# EAGLE design 51-zduino (EAGLE 5.07)
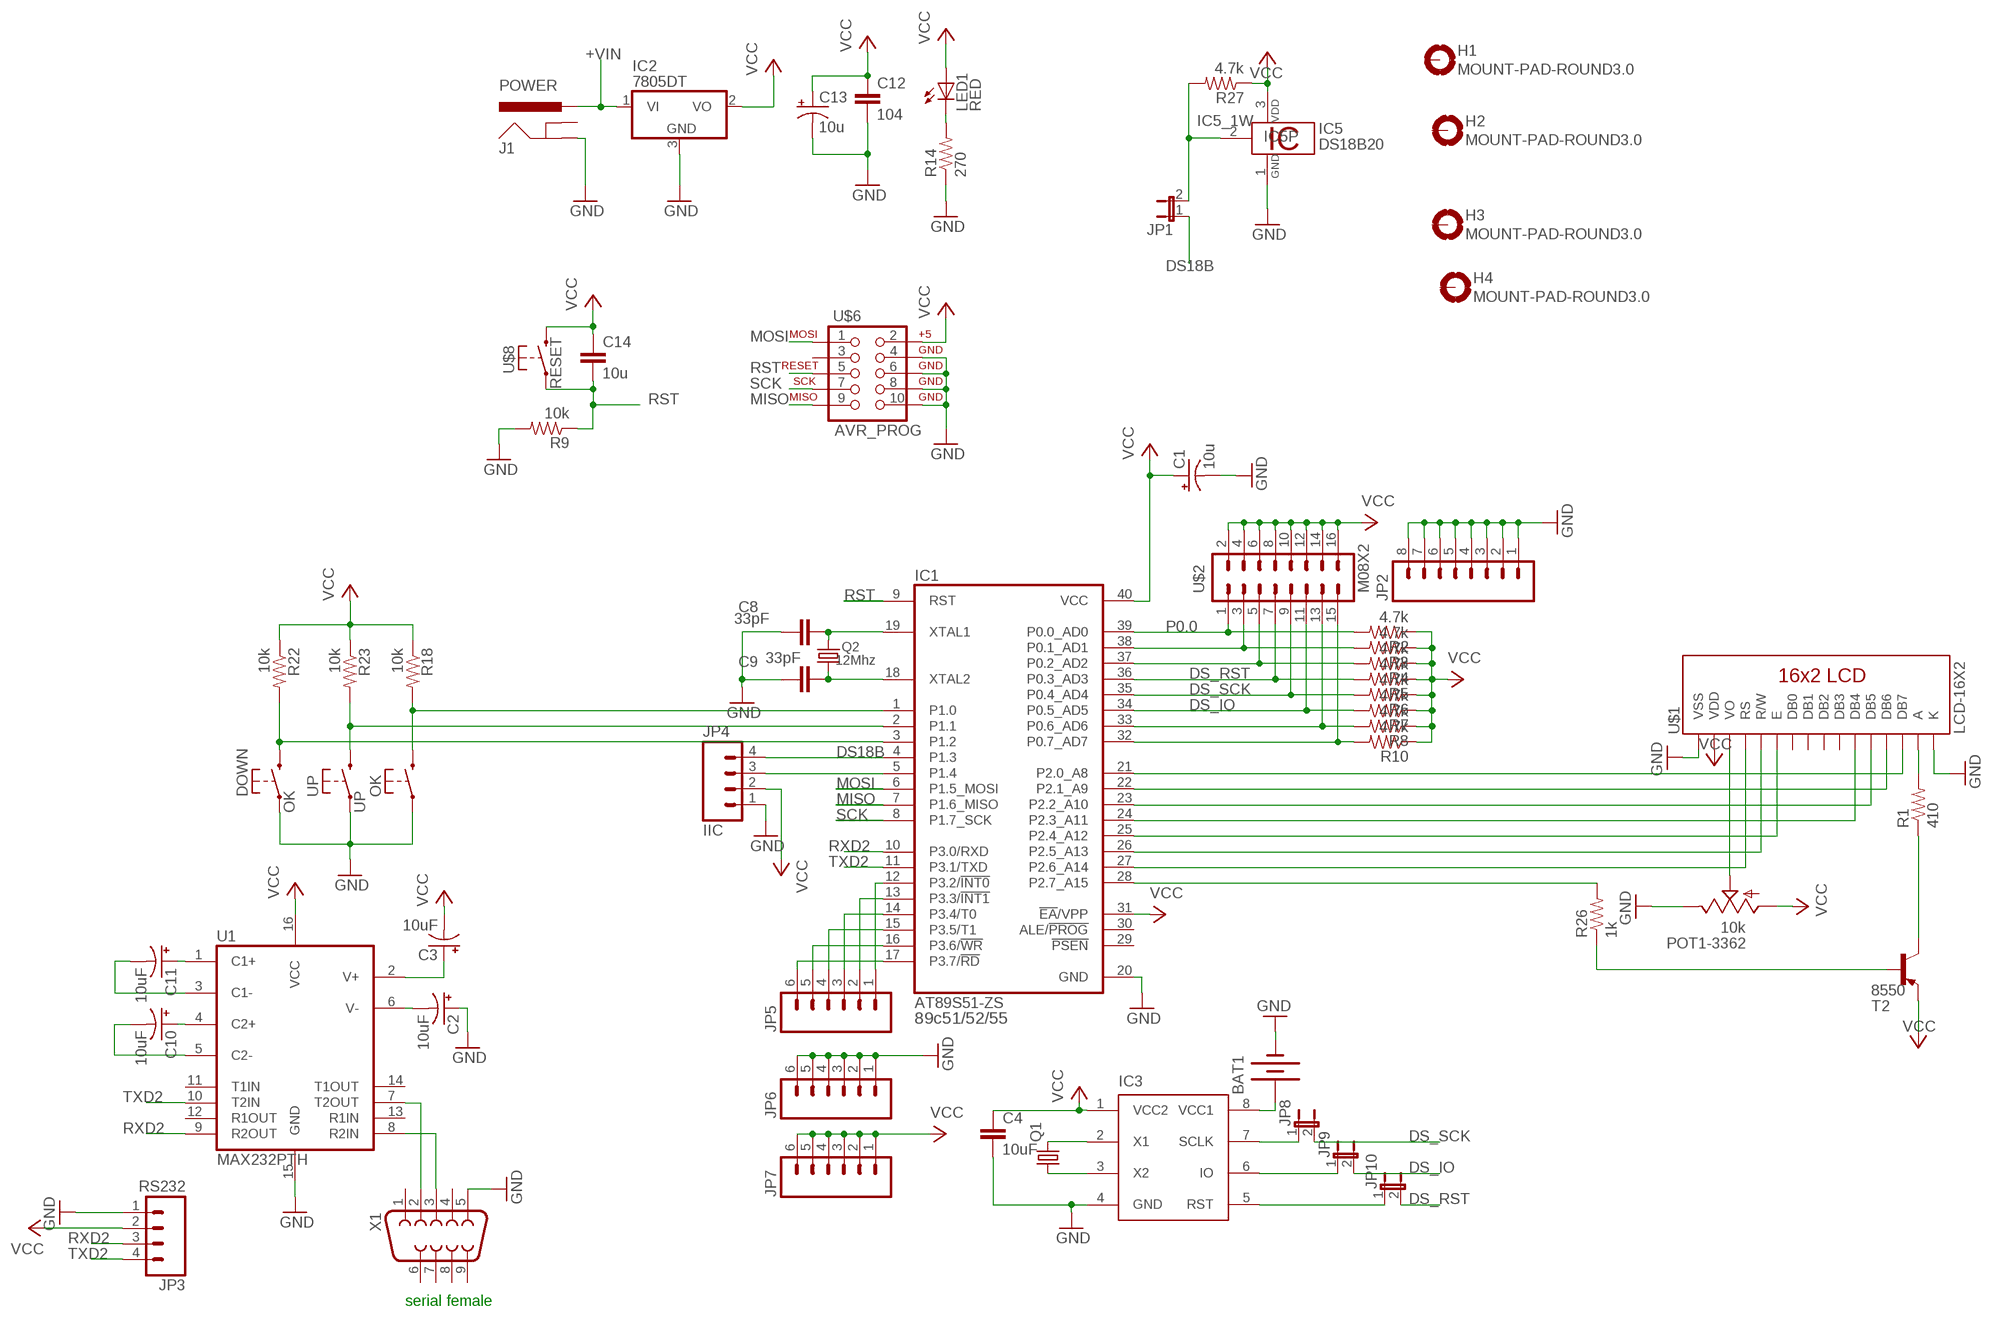
[diagram p0: schematic, sheet 1]

## Parts
BAT1  BATTERY20PTH  [BATTCOM_20MM_PTH]
C1  10u  CAP_POL1206  [EIA3216]
C2  10uF  CAP_POL3528  [EIA3528]
C3  10uF  CAP_POL3528  [EIA3528]
C4  10uF  CAPC1206K  [C1206K]
C8  33pF  CAPPTH1  [CAP-PTH-5MM]
C9  33pF  CAPPTH1  [CAP-PTH-5MM]
C10  10uF  CAP_POL3528  [EIA3528]
C11  10uF  CAP_POL3528  [EIA3528]
C12  104  CAP0805  [0805]
C13  10u  CAP_POL1206  [EIA3216]
C14  10u  CAPSMD  [GRM43D]
DOWN  OK  TACT_SWITCH-2-PTH  [ALPS-SKHV]
H1  MOUNT-PAD-ROUND3.0  [3,0-PAD]
H2  MOUNT-PAD-ROUND3.0  [3,0-PAD]
H3  MOUNT-PAD-ROUND3.0  [3,0-PAD]
H4  MOUNT-PAD-ROUND3.0  [3,0-PAD]
IC1  AT89S51-ZS  AT89S51-ZS-1280  [240-1280-00-0602J]
IC2  7805DT  [TO252]
IC3  DS1302  [PDIP8]
IC5  DS18B20  [TO92-]
J1  POWER  POWER_JACKPTH_BIG  [POWER_JACK_2.1X5.5_BIG_PTH]
JP1  JUMPER-2PTH_LOCK  [1X02_LOCK]
JP2  M08LOCK  [1X08_LOCK]
JP3  RS232  M04LOCK_LONGPADS  [1X04_LOCK_LONGPADS]
JP4  IIC  M04LOCK_LONGPADS  [1X04_LOCK_LONGPADS]
JP5  M06SIP  [1X06]
JP6  M06SIP  [1X06]
JP7  M06SIP  [1X06]
JP8  JUMPER-2PTH_LOCK  [1X02_LOCK]
JP9  JUMPER-2PTH_LOCK  [1X02_LOCK]
JP10  JUMPER-2PTH_LOCK  [1X02_LOCK]
LED1  RED  LED3MM  [LED3MM]
OK  TACT_SWITCH-2-PTH  [ALPS-SKHV]
POT1-3362  10k  POTB25P-3362P  [B25P]
Q1  CRYSTALTC38H  [TC38H]
Q2  12Mhz  CRYSTALHC49UV-SOCK  [HC49U-V-SOCK]
R1  410  RESISTOR0805  [0805]
R2  4.7k  RESISTOR0805  [0805]
R3  4.7k  RESISTOR0805  [0805]
R4  4.7k  RESISTOR0805  [0805]
R5  4.7k  RESISTOR0805  [0805]
R6  4.7k  RESISTOR0805  [0805]
R7  4.7k  RESISTOR0805  [0805]
R8  4.7k  RESISTOR0805  [0805]
R9  10k  RESISTOR0805  [0805]
R10  4.7k  RESISTOR0805  [0805]
R14  270  RESISTOR0805  [0805]
R18  10k  RESISTOR0805  [0805]
R22  10k  RESISTOR0805  [0805]
R23  10k  RESISTOR0805  [0805]
R26  1k  RESISTOR0805  [0805]
R27  4.7k  RESISTOR0805  [0805]
T2  8550  -PNP-SOT23-BEC  [SOT23-BEC]
U1  MAX232PTH  [DIL16]
U$1  LCD-16X2  [LCD-16X2]
U$2  M08X2  [2X8]
U$6  AVR_PROG  AVR_SPI_PROG2LOCK  [2X5-SHROUDED_LOCK]
U$8  RESET  TACT_SWITCH-2-PTH  [ALPS-SKHV]
UP  UP  TACT_SWITCH-2-PTH  [ALPS-SKHV]
X1  DB9  [DB9]

## Nets
1W: IC5.2 JP1.2 R27.2
+VIN: IC2.1(VI) J1.PWR
DS18B: IC1.4(P1.3) JP1.1 JP4.4
DS_IO: IC1.34(P0.5_AD5) JP9.2 R7.2 U$2.11
DS_RST: IC1.36(P0.3_AD3) JP10.2 R5.2 U$2.7
DS_SCK: IC1.35(P0.4_AD4) JP8.2 R6.2 U$2.9
GND: BAT1.2(-) C1.C(-) C2.A(+) C4.2 C8.2 C9.2 C12.2 C13.C(-) DOWN.2 IC1.20(GND) IC2.3(GND) IC3.4(GND) IC5.1 J1.GND JP2.1 JP2.2 JP2.3 JP2.4 JP2.5 JP2.6 JP2.7 JP2.8 JP3.1 JP4.1 JP6.1 JP6.2 JP6.3 JP6.4 JP6.5 JP6.6 OK.2 POT1-3362.E R9.2 R14.1 U1.15(GND) U$1.1(VSS) U$1.16(K) U$6.4 U$6.6 U$6.8 U$6.10 UP.2 X1.5
KD: IC1.1(P1.0) OK.3 R18.2
KO: DOWN.3 IC1.3(P1.2) R22.2
KU: IC1.2(P1.1) R23.2 UP.3
MISO: IC1.7(P1.6_MISO) U$6.9
MOSI: IC1.6(P1.5_MOSI) U$6.1
N$1: IC1.27(P2.6_A14) U$1.4(RS)
N$2: IC1.26(P2.5_A13) U$1.5(R/W)
N$3: IC1.25(P2.4_A12) U$1.6(E)
N$4: IC1.24(P2.3_A11) U$1.11(DB4)
N$5: IC1.23(P2.2_A10) U$1.12(DB5)
N$6: C2.C(-) U1.6(V-)
N$7: IC1.21(P2.0_A8) U$1.14(DB7)
N$8: C10.C(-) U1.5(C2-)
N$9: C10.A(+) U1.4(C2+)
N$10: C11.A(+) U1.1(C1+)
N$11: C3.A(+) U1.2(V+)
N$12: C11.C(-) U1.3(C1-)
N$13: U1.7(T2OUT) X1.2
N$14: C9.1 IC1.18(XTAL2) Q2.1
N$15: POT1-3362.S U$1.3(VO)
N$16: R1.2 U$1.15(A)
N$17: LED1.K(C) R14.2
N$18: IC1.28(P2.7_A15) R26.2
N$19: R1.1 T2.C
N$20: IC1.38(P0.1_AD1) R3.2 U$2.3
N$21: IC1.37(P0.2_AD2) R4.2 U$2.5
N$23: IC1.22(P2.1_A9) U$1.13(DB6)
N$24: U1.8(R2IN) X1.3
N$27: IC1.33(P0.6_AD6) R8.2 U$2.13
N$28: IC1.32(P0.7_AD7) R10.2 U$2.15
N$29: IC1.5(P1.4) JP4.3
N$30: IC1.12(P3.2/!INT0) JP5.1
N$31: IC1.13(P3.3/!INT1) JP5.2
N$32: IC1.14(P3.4/T0) JP5.3
N$33: IC1.15(P3.5/T1) JP5.4
N$34: C8.1 IC1.19(XTAL1) Q2.2
N$35: IC1.16(P3.6/!WR) JP5.5
N$36: IC1.17(P3.7/!RD) JP5.6
N$37: IC3.2(X1) Q1.2
N$38: IC3.3(X2) Q1.1
N$39: BAT1.1(+) IC3.8(VCC1)
N$40: IC3.7(SCLK) JP8.1
N$41: IC3.6(IO) JP9.1
N$42: IC3.5(RST) JP10.1
N$55: R26.1 T2.B
P0.0: IC1.39(P0.0_AD0) R2.2 U$2.1
RST: C14.C IC1.9(RST) R9.1 U$6.5 U$8.2
RXD2: IC1.10(P3.0/RXD) JP3.3 U1.9(R2OUT)
SCK: IC1.8(P1.7_SCK) U$6.7
TXD2: IC1.11(P3.1/TXD) JP3.4 U1.10(T2IN)
VCC: C1.A(+) C3.C(-) C4.1 C12.1 C13.A(+) C14.A IC1.31(!EA!/VPP) IC1.40(VCC) IC2.2(VO) IC3.1(VCC2) IC5.3 JP3.2 JP4.2 JP7.1 JP7.2 JP7.3 JP7.4 JP7.5 JP7.6 LED1.A POT1-3362.A R2.1 R3.1 R4.1 R5.1 R6.1 R7.1 R8.1 R10.1 R18.1 R22.1 R23.1 R27.1 T2.E U1.16(VCC) U$1.2(VDD) U$2.2 U$2.4 U$2.6 U$2.8 U$2.10 U$2.12 U$2.14 U$2.16 U$6.2 U$8.3
Unconnected: H1.B3,0(MOUNT) H2.B3,0(MOUNT) H3.B3,0(MOUNT) H4.B3,0(MOUNT) IC1.29(!PSEN) IC1.30(ALE/!PROG) J1.GNDBREAK U1.11(T1IN) U1.12(R1OUT) U1.13(R1IN) U1.14(T1OUT) U$1.7(DB0) U$1.8(DB1) U$1.9(DB2) U$1.10(DB3) U$6.3 X1.1 X1.4 X1.6 X1.7 X1.8 X1.9

## Notes on the sheet
- 89c51/52/55
- serial female

## Library data of the parts
BAT1 = SparkFun:BATTERY: Battery Holders Various common sizes : AA, AAA, 20mm coin cell and 12mm coin cell.
C1 C13 = SparkFun:CAP_POL: Capacitor Polarized
C2 C3 C10 C11 = digital-toy:CAP_POL: Capacitor Polarized
C4 C8 C9 = digital-toy:CAP: Capacitor Standard 0603 ceramic capacitor, and 0.1" leaded capacitor.
C12 C14 = SparkFun:CAP: Capacitor Standard 0603 ceramic capacitor, and 0.1" leaded capacitor.
DOWN OK U$8 UP = digital-toy:TACT_SWITCH-2
H1-H4 = holes:MOUNT-PAD-ROUND: MOUNTING PAD, round
IC1 = digital-toy:AT89S51-*: 8-bit Microcontroller with 4K BytesIn-System Programmable Flash Source: http://www.atmel.com/dyn/resources/prod_documents/doc2487.pdf
IC2 = linear:78*: Positive VOLTAGE REGULATOR Source: http://cache.national.com/ds/LM/LM78L05.pdf http://www.fairchildsemi.com/ds/LM/LM7805.pdf
IC3 = ltc1440_lt1529_ds1302:DS1302: DS1302 Realtime Clock The DS1302 trickle-charge timekeeping chip contains a real-time clock/calendar and 31 bytes of static RAM. It communicates with a microprocessor via a simple serial interface. The real-time clock/calendar provides seconds, minutes, hours, day, date, month, and year information. The end of the month date is automatically adjusted for months with fewer than 31 days, including corrections for leap year. The clock operates in either the 24-hour or 12-hour format with an AM/PM indicator. Interfacing the DS1302 with a microprocessor is simplified by using synchronous serial communication. Only three wires are required to communicate with the clock/RAM: CE, I/O (data line), and SCLK (serial clock). Data can be transferred to and from the clock/RAM 1 byte at a time or in a burst of up to 31 bytes. The DS1302 is designed to operate on very low power and retain data and clock information on less than 1µW. The DS1302 is the successor to the DS1202. In addition to the basic timekeeping functions of the DS1202, the DS1302 has the additional features of dual power pins for primary and backup power supplies, programmable trickle charger for VCC1, and seven additional bytes of scratchpad memory.
IC5 = digital-toy:DS18B20: Programmable Resolution Digital Thermometer This chip provides a onewire thermosensor with approx. 0.5°C accuracy. A programmable over/undertemperure alarm is available. The precision can be set from 9..12 bits. Notes: Vdd must be applied for accurate measurements at low temperatures, as the parasite power circuit otherwise heats the sensor. If parasite power is used, Vdd has to be connected to GND. The DS1822 is a low-cost thermometer chip, the DS18S20 is similar to the DS18B20, but with 9 Bit precision only. Author: Jan Kandziora <jjj@gmx.de>
J1 = digital-toy:POWER_JACK: Power Jack This is the standard 5.5mm barrel jack for power. The PTH is the most common, proven, reliable, footprint. All others are experimental. The Slot footprint only works if the mill layer is transmitted to the PCB fab house so be warned. Spark Fun Electronics SKU : PRT-00119. Mating wall wart : TOL-00298 (and others)
JP1 JP8-JP10 = SparkFun:JUMPER-2: Jumper Basic 0.1" spaced jumper. Use with breakaway headers.
JP2 = SparkFun:M08: Header 8 Standard 8-pin 0.1" header. Use with straight break away headers (SKU : PRT-00116), right angle break away headers (PRT-00553), swiss pins (PRT-00743), machine pins (PRT-00117), and female headers (PRT-00115).
JP3 JP4 = SparkFun:M04: Header 4 Standard 4-pin 0.1" header. Use with straight break away headers (SKU : PRT-00116), right angle break away headers (PRT-00553), swiss pins (PRT-00743), machine pins (PRT-00117), and female headers (PRT-00115). Molex polarized connector foot print use with SKU : PRT-08231 with associated crimp pins and housings.
JP5-JP7 = SparkFun:M06: Header 6 Standard 6-pin 0.1" header. Use with straight break away headers (SKU : PRT-00116), right angle break away headers (PRT-00553), swiss pins (PRT-00743), machine pins (PRT-00117), and female headers (PRT-00115). Molex polarized connector foot print use with SKU : PRT-08094 with associated crimp pins and housings. NOTES ON THE VARIANTS LOCK and LOCK_LONGPADS... This footprint was designed to help hold the alignment of a through-hole component (i.e. 6-pin header) while soldering it into place. You may notice that each hole has been shifted either up or down by 0.005 of an inch from it's more standard position (which is a perfectly straight line). This slight alteration caused the pins (the squares in the middle) to touch the edges of the holes. Because they are alternating, it causes a "brace" to hold the component in place. 0.005 has proven to be the perfect amount of "off-center" position when using our standard breakaway headers. Although looks a little odd when you look at the bare footprint, once you have a header in there, the alteration is very hard to notice. Also, if you push a header all the way into place, it is covered up entirely on the bottom side. This idea of altering the position of holes to aid alignment will be further integrated into the Sparkfun Library for other footprints. It can help hold any component with 3 or more connection pins.
LED1 = digital-toy:LED: LEDs Standard schematic elements and footprints for 5mm, 3mm, 1206, and 0603 sized LEDs. 5mm - Spark Fun Electronics SKU : COM-00529 (and others) copy led.lbr 0805 led here, by hyl digital-toy. 2010.6.29
POT1-3362 = digital-toy:POT: POT digital toy POT, 3296 multi turn, blue-white ... hyl 8/07/2001
Q1 = SparkFun:CRYSTAL: Crystals Various standard crystals. Proven footprints. Spark Fun Electronics SKU : COM-00534
Q2 = digital-toy:CRYSTAL: Crystals Various standard crystals. Proven footprints. Spark Fun Electronics SKU : COM-00534
R1-R10 R14 R18 R22 R23 R26 R27 = digital-toy:RESISTOR: Resistor Basic schematic elements and footprints for 0603, 1206, and PTH 1/10th watt (small) resistors. digital-toy copy vertical mount of axial-0.3 from rcl.lbr : the 0207/xx
T2 = digital-toy:*-PNP-: PNP Transistror
U1 = SparkFun:MAX232: RS232 Transceiver Very common IC. This is generically called 'MAX232', but works with the 3V equivalent MAX3232 generic ICs. Field tested and mother approved. Spark Fun Electronics SKU : COM-00316 (DIP) and COM-00589 (SMD)
U$1 = digital-toy:LCD-16X2
U$2 = SparkFun:M08X2
U$6 = SparkFun:AVR_SPI_PROG2: AVR ICSP Header This is the standard AVR In Circuit Serial Programming header. Minimal, but includes pin one indicator. Works with standard Olimex programmers. Also look for the 6-pin reduced version. Spark Fun Electronics SKU: PRT-00778
X1 = SparkFun:DB9: DB9 Connector Standard DB9 (D-Sub 9) serial connector. Can be used for CAN bus as well as RS485 and RS232. Footprint production proven. Spark Fun Electronics SKU : PRT-00429

## Board
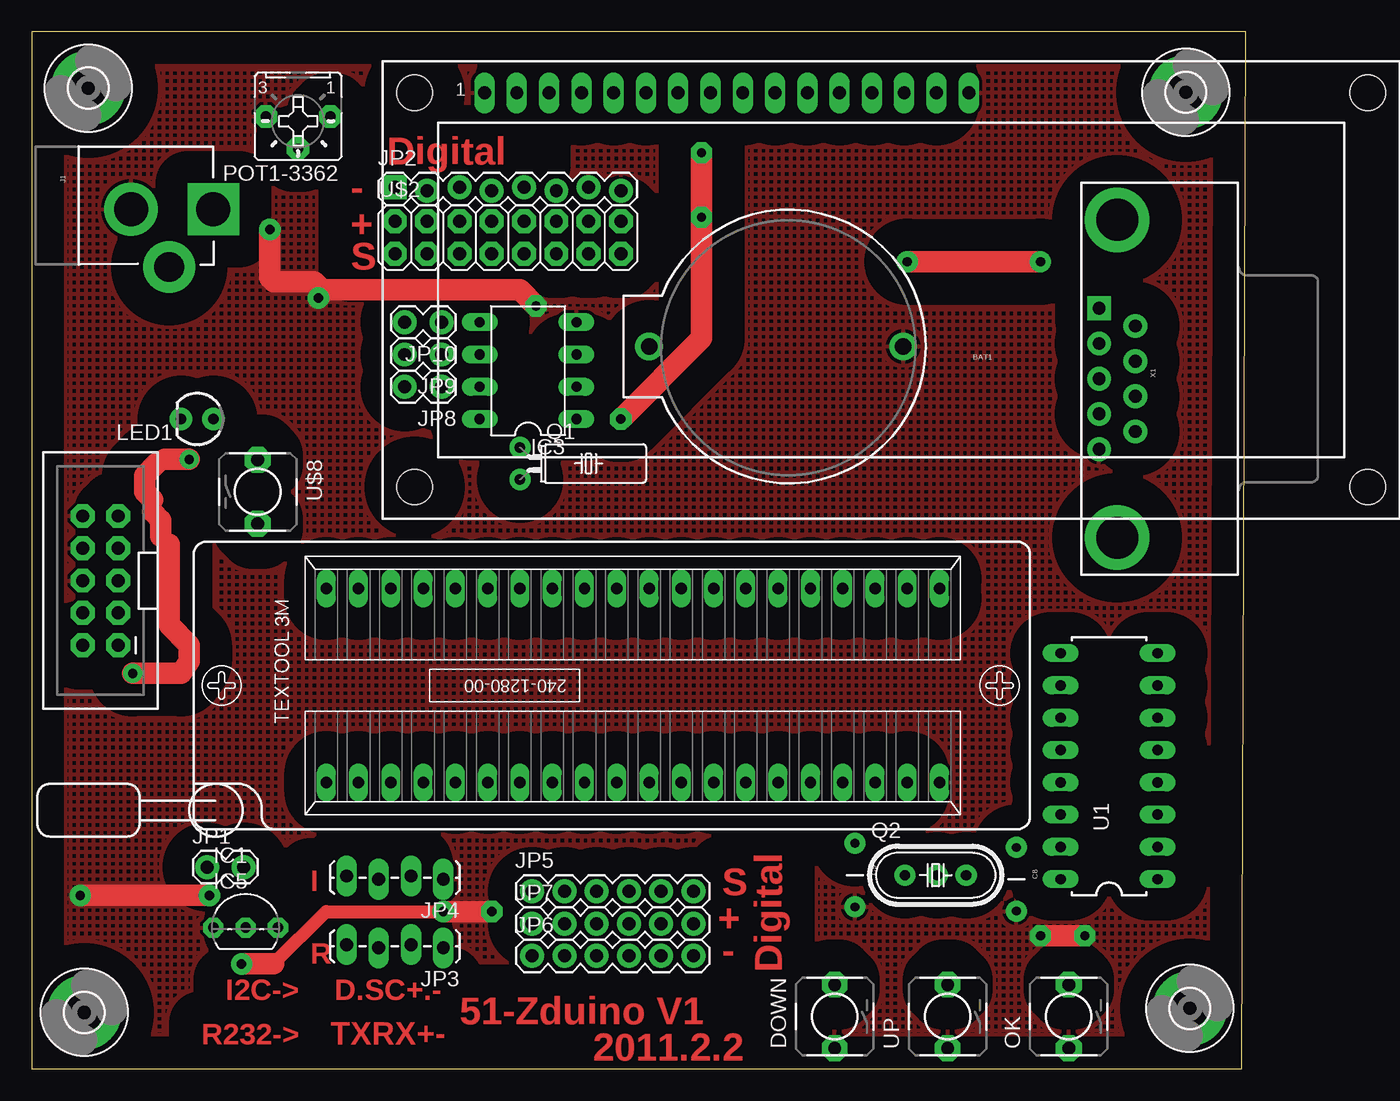
[diagram p1: board, top side]
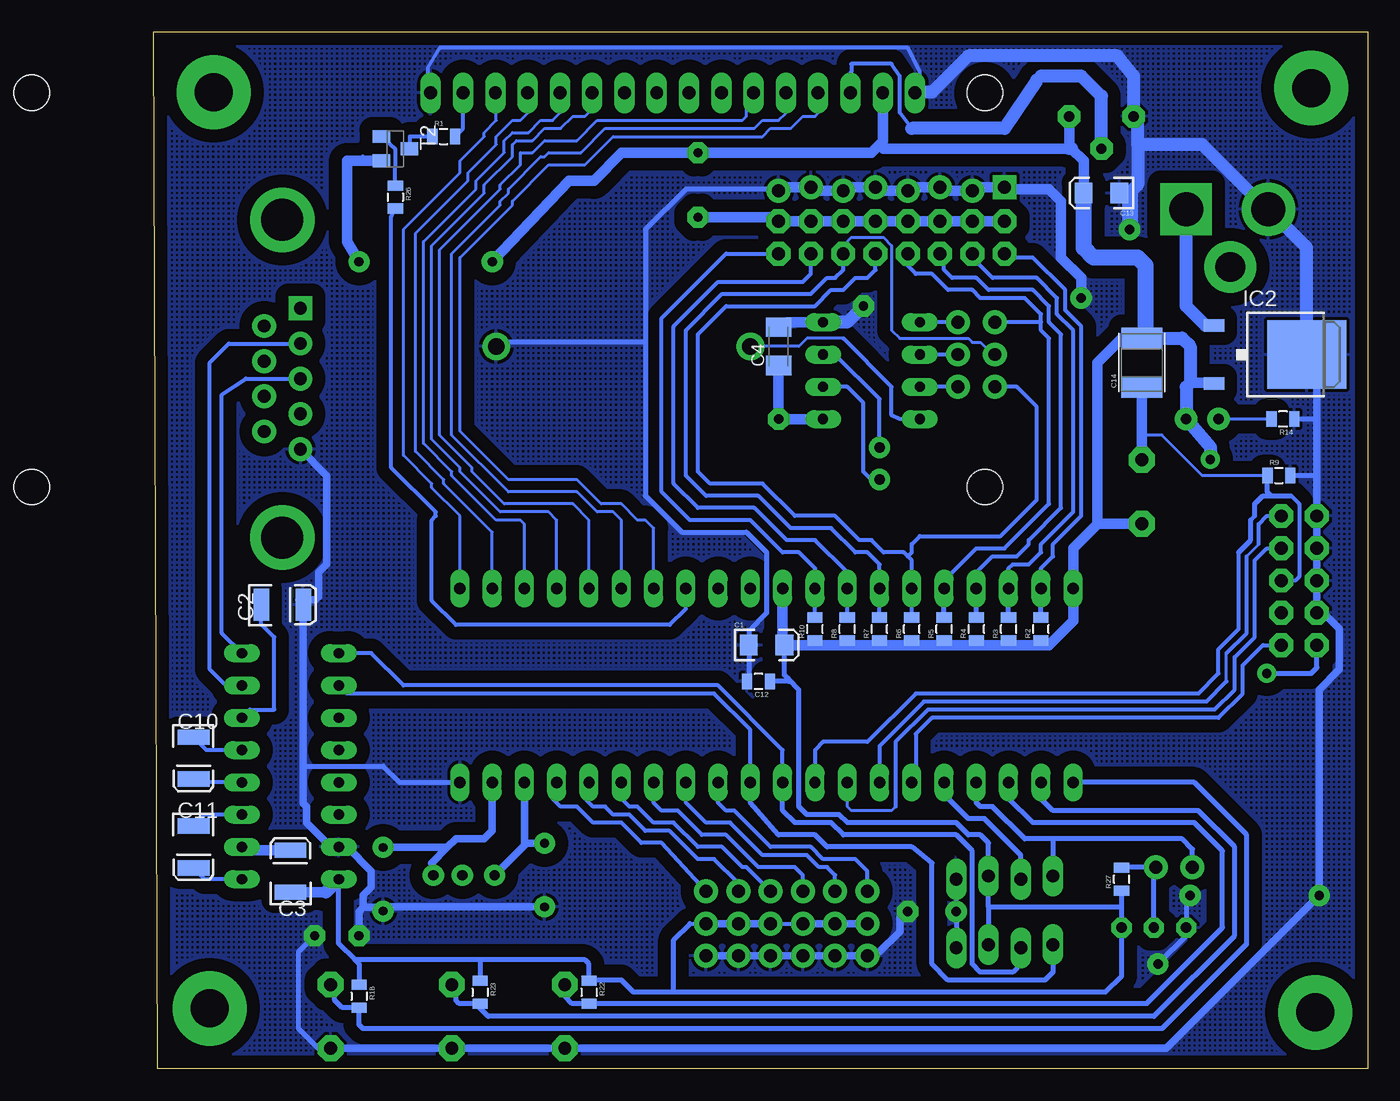
[diagram p2: board, bottom side, seen from below]

Size 95.55 x 81.58 mm. Coordinates in mm from the lower left corner, seen from the top.
Outline: 0,0 95.23,0 95.55,81.58 0,81.58 0,0
Copper layers (1*16): Top 0.035mm / dielectric 1.5mm / Bottom 0.035mm
Design rules "SparkFun-HP1007-600x600dpi *": minimum track width 10mil, minimum drill 20mil, track to track 8mil, track to pad 8mil, pad to pad 8mil, via to via 8mil, smd to smd 8mil, copper to edge 12mil, drill to drill 28mil, minimum pad ring 12mil, minimum via ring 10mil, stop-mask expansion 4mil, vias tented up to drill 25mil, thermal gap 10mil

### Footprints (pad centres in the part's own frame; a part is rotated, then mirrored left to right if it is on the bottom)
BATTCOM_20MM_PTH = drill 1.3 pad 2.184 round: 1 20,0; 2 0,0
EIA3216 = smd 1.4 x 1.6: A 1.4,0; C -1.4,0
EIA3528 = smd 1.2 x 2.5: A 1.65,0; C -1.65,0
C1206K = smd 1.5 x 2: 1 -1.5,0; 2 1.5,0
CAP-PTH-5MM = drill 0.7 pad 1.651 round: 1 -2.5,0; 2 2.5,0
0805 = smd 0.8 x 1.2: 1 -0.9,0; 2 0.9,0
GRM43D = smd 1.65 x 3.2: A 1.927,0; C -1.927,0
ALPS-SKHV = drill 1.016 pad 2.032 octagon: 2 -2.51,0; 3 2.51,0
3,0-PAD = drill 3 pad 5.842 round: B3,0 0,0
240-1280-00-0602J = drill 0.9 long: 1 -24.13,-7.62; 2 -21.59,-7.62; 3 -19.05,-7.62; 4 -16.51,-7.62; 5 -13.97,-7.62; 6 -11.43,-7.62; 7 -8.89,-7.62; 8 -6.35,-7.62; 9 -3.81,-7.62; 10 -1.27,-7.62; 11 1.27,-7.62; 12 3.81,-7.62; 13 6.35,-7.62; 14 8.89,-7.62; 15 11.43,-7.62; 16 13.97,-7.62; 17 16.51,-7.62; 18 19.05,-7.62; 19 21.59,-7.62; 20 24.13,-7.62; 21 24.13,7.62; 22 21.59,7.62; 23 19.05,7.62; 24 16.51,7.62; 25 13.97,7.62; 26 11.43,7.62; 27 8.89,7.62; 28 6.35,7.62; 29 3.81,7.62; 30 1.27,7.62; 31 -1.27,7.62; 32 -3.81,7.62; 33 -6.35,7.62; 34 -8.89,7.62; 35 -11.43,7.62; 36 -13.97,7.62; 37 -16.51,7.62; 38 -19.05,7.62; 39 -21.59,7.62; 40 -24.13,7.62
TO252 = smd 1 x 1.6: 1 -2.28,-4.8; 2 2.28,-4.8 | smd 5.4 x 6.2: 3 0,2.5
PDIP8 = drill 0.813 long: 1 -3.81,-3.81; 2 -1.27,-3.81; 3 1.27,-3.81; 4 3.81,-3.81; 5 3.81,3.81; 6 1.27,3.81; 7 -1.27,3.81; 8 -3.81,3.81
TO92- = drill 0.813 pad 1.575 octagon: 1 -2.54,0; 2 0,0; 3 2.54,0
POWER_JACK_2.1X5.5_BIG_PTH = drill 2.667 pad 4.191 round: GND 0,-0.127 | drill 2.337 pad 4.064 round: GNDBREAK 4.547,2.87 | drill 2.667 pad 4.064 square: PWR 0,6.35
1X02_LOCK = drill 1.016 pad 1.88 round: 1 -1.448,0; 2 1.448,0
1X08_LOCK = drill 1.016 pad 1.88 square: 1 -8.89,0.127 | drill 1.016 pad 1.88 round: 2 -6.35,-0.127; 3 -3.81,0.127; 4 -1.27,-0.127; 5 1.27,0.127; 6 3.81,-0.127; 7 6.35,0.127; 8 8.89,-0.127
1X04_LOCK_LONGPADS = drill 1.016 long: 1 -3.81,0; 2 -1.27,-0.254; 3 1.27,0; 4 3.81,-0.254
1X06 = drill 1.016 pad 1.88 round: 1 -6.35,0; 2 -3.81,0; 3 -1.27,0; 4 1.27,0; 5 3.81,0; 6 6.35,0
LED3MM = drill 0.813 pad 1.778 round: A -1.27,0; K 1.27,0
B25P = drill 0.813 pad 1.778 octagon: A -2.54,0; E 2.54,0; S 0,2.54
TC38H = drill 0.813 pad 1.676 round: 1 -1.27,0; 2 1.27,0
HC49U-V-SOCK = drill 0.813 pad 1.676 round: 1 -2.413,0; 2 2.413,0; 3 0.127,0
SOT23-BEC = smd 1 x 1.4: B -0.95,-1.1; C 0,1.1; E 0.95,-1.1
DIL16 = drill 0.813 long: 1 -8.89,-3.81; 2 -6.35,-3.81; 3 -3.81,-3.81; 4 -1.27,-3.81; 5 1.27,-3.81; 6 3.81,-3.81; 7 6.35,-3.81; 8 8.89,-3.81; 9 8.89,3.81; 10 6.35,3.81; 11 3.81,3.81; 12 1.27,3.81; 13 -1.27,3.81; 14 -3.81,3.81; 15 -6.35,3.81; 16 -8.89,3.81
LCD-16X2 = drill 1.016 long: 1 -32,15.5; 2 -29.46,15.5; 3 -26.92,15.5; 4 -24.38,15.5; 5 -21.84,15.5; 6 -19.3,15.5; 7 -16.76,15.5; 8 -14.22,15.5; 9 -11.68,15.5; 10 -9.14,15.5; 11 -6.6,15.5; 12 -4.06,15.5; 13 -1.52,15.5; 14 1.02,15.5; 15 3.56,15.5; 16 6.1,15.5 | hole 2.8: -37.5,15.5; -37.5,-15.5; 37.5,15.5; 37.5,-15.5
2X8 = drill 1.016 pad 1.88 octagon: 1 -8.89,-1.27; 2 -8.89,1.27; 3 -6.35,-1.27; 4 -6.35,1.27; 5 -3.81,-1.27; 6 -3.81,1.27; 7 -1.27,-1.27; 8 -1.27,1.27; 9 1.27,-1.27; 10 1.27,1.27; 11 3.81,-1.27; 12 3.81,1.27; 13 6.35,-1.27; 14 6.35,1.27; 15 8.89,-1.27; 16 8.89,1.27
2X5-SHROUDED_LOCK = drill 1.016 pad 1.88 octagon: 1 -5.08,-1.397; 2 -5.08,1.397; 3 -2.54,-1.397; 4 -2.54,1.397; 5 0,-1.397; 6 0,1.397; 7 2.54,-1.397; 8 2.54,1.397; 9 5.08,-1.397; 10 5.08,1.397
DB9 = drill 1.016 pad 1.88 square: 1 5.54,1.42 | drill 1.016 pad 1.88 round: 2 2.77,1.42; 3 0,1.42; 4 -2.77,1.42; 5 -5.54,1.42; 6 4.15,-1.42; 7 1.38,-1.42; 8 -1.38,-1.42; 9 -4.15,-1.42 | drill 3.302 pad 5.08 round: G1 12.5,0; G2 -12.5,0

### Placement (x,y rotation side)
BAT1  68.58,56.83 180 top
C1  47.31,33.34 0 bottom
C2  85.41,36.51 0 bottom
C3  84.77,15.56 90 bottom
C4  46.35,56.83 90 bottom
C8  77.47,14.92 270 top
C9  64.77,15.24 270 top
C10  92.39,24.45 270 bottom
C11  92.39,17.46 270 bottom
C12  47.94,30.48 180 bottom
C13  20.95,68.9 180 bottom
C14  17.78,55.56 90 bottom
DOWN  63.18,4.13 90 top
H1  4.13,4.45 0 top
H2  91.12,4.76 0 top
H3  90.81,76.83 0 top
H4  4.45,77.15 0 top
IC1  47.31,30.16 0 top
IC2  7.3,56.2 270 bottom
IC3  39.05,54.93 90 top
IC5  16.83,11.11 0 top
J1  7.94,67.63 270 top
JP1  15.24,15.88 0 top
JP2  37.47,69.22 0 top
JP3  28.57,9.53 180 top
JP4  28.57,14.92 180 top
JP5  45.72,13.97 0 top
JP6  45.72,8.89 0 top
JP7  45.72,11.43 0 top
JP8  30.8,53.66 180 top
JP9  30.8,56.2 180 top
JP10  30.8,58.74 180 top
LED1  13.02,51.12 180 top
OK  81.6,4.13 90 top
POT1-3362  20.95,74.93 180 top
Q1  38.42,47.62 270 top
Q2  71.12,15.24 0 top
R1  72.71,73.34 0 bottom
R2  25.72,34.61 90 bottom
R3  28.26,34.61 90 bottom
R4  30.8,34.61 90 bottom
R5  33.34,34.61 90 bottom
R6  35.88,34.61 90 bottom
R7  38.42,34.61 90 bottom
R8  40.96,34.61 90 bottom
R9  6.99,46.67 0 bottom
R10  43.5,34.61 90 bottom
R14  6.67,51.12 180 bottom
R18  79.38,5.71 270 bottom
R22  61.28,6.03 270 bottom
R23  69.85,6.03 270 bottom
R26  76.52,68.58 270 bottom
R27  19.37,14.92 90 bottom
T2  76.52,72.39 270 bottom
U1  84.77,23.81 90 top
U$1  67.63,61.28 0 top
U$2  37.47,65.41 0 top
U$6  5.4,38.42 90 top
U$8  17.78,45.4 270 top
UP  72.07,4.13 90 top
X1  85.41,54.29 90 top

### Tracks (layer width: path | path; a pad name or v marks a point on that pad's centre or on a via)
1W
  Bottom 0.406: IC5.2 16.83,15.73 JP1.2 19.32,15.88 R27.2
+VIN
  Bottom 1.016: IC2.1 12.76,58.48 14.29,60.01 J1.PWR
DS18B
  Bottom 0.406: IC1.4 30.8,20.95 30.48,20.64 29.53,20.64 26.99,18.1 24.77,18.1 | 24.77,18.1 JP4.4 | JP1.1 13.79,17.29 14.61,18.1 24.77,18.1
DS_IO
  Bottom 0.254: 29.53,56.2 30.48,57.15 31.11,57.15 31.43,57.47 36.83,57.47 37.47,58.1 37.47,64.77 38.1,65.41 40.64,65.41 41.27,64.77 U$2.11
  Bottom 0.305: R7.2 IC1.34 38.42,39.69 39.37,40.64 40.32,40.64 42.23,42.55 45.4,42.55 47.94,45.09 52.07,45.09 53.66,46.67 53.66,58.1 50.8,60.96 43.81,60.96 42.55,62.23 41.91,62.23 41.27,62.87 U$2.11 | 29.53,56.2 JP9.2
DS_RST
  Bottom 0.305: IC1.36 33.34,38.42 30.8,40.96 28.57,40.96 25.08,44.45 25.08,57.47 25.72,58.1 25.72,58.74 | 25.72,58.74 25.72,59.37 26.99,60.64 30.48,60.64 31.11,61.28 33.02,61.28 34.29,62.55 35.56,62.55 36.2,63.18 U$2.7 | 25.72,58.74 JP10.2
  Bottom 0.406: R5.2 IC1.36
DS_SCK
  Bottom 0.305: R6.2 IC1.35 35.88,40.01 36.2,40.32 | 36.2,40.32 36.51,40.64 38.1,40.64 39.05,41.59 40.01,41.59 41.91,43.5 45.09,43.5 47.62,46.04 51.75,46.04 52.7,46.99 52.7,57.78 50.48,60.01 43.5,60.01 42.23,61.28 41.27,61.28 40.32,62.23 39.37,62.23 38.73,62.87 U$2.9 | JP8.2 27.62,53.66 26.04,52.07 26.04,44.77 28.89,41.91 35.24,41.91 35.88,41.27 35.88,40.64 36.2,40.32
GND  (via drill 0.74 pad 1.68)
  Top 1.016: 19.05,8.26 23.18,12.38 v32.38,12.38
  Top 1.27: 22.54,61.59 v22.54,60.64 | 18.73,62.23 19.05,61.91
  Top 1.676: v3.81,13.65 v13.97,13.65 | v16.51,8.26 19.05,8.26 | v82.87,10.48 v79.38,10.48 | 22.54,61.59 22.23,61.91 19.05,61.91 | v18.73,66.04 18.73,62.23 | v32.38,12.38 v36.2,12.38 | v22.54,60.64 23.18,61.28 38.42,61.28 v39.69,60.01
  Bottom 0.254: 4,56.03 IC2.3 | 73.03,80.33 73.98,78.74
  Bottom 0.305: 73.03,80.33 36.2,80.33 35.24,78.42 35.24,77.16 | 73.98,78.74 73.98,77.03 U$1.16 | C2.A 84.14,36.89 | U1.15 81.6,17.46 | 82.81,36.89 82.55,37.15 | JP2.1 28.45,69.22 | JP6.1 38.73,9.21
  Bottom 0.406: 4,51.12 R14.1 | 4,46.67 R9.2 | 3.49,35.88 U$6.4 | 18.73,68.9 C13.C | 18.1,74.61 POT1-3362.E | 35.57,76.83 U$1.1 | UP.2 DOWN.2 | 77.15,12.74 C8.2 77.75,12.7 | IC1.20 76.2,22.54 77.47,23.81 83.76,23.81 | JP4.1 v32.38,12.38 JP3.1 | v13.97,13.65 14.29,13.34 IC5.1 14.29,10.48 v16.51,8.26 | v82.87,10.48 84.14,9.21 84.14,3.17 82.55,1.59 81.63,1.59 OK.2 | 56.83,57.15 56.83,66.04 53.66,69.22 46.48,69.22 JP2.8 | 56.83,57.15 56.83,45.09 53.98,42.23 48.9,42.23 47.31,40.64 47.31,35.88 48.71,34.48 C1.C 48.71,30.48 C12.2 | BAT1.2 68.26,57.15 56.83,57.15
  Bottom 0.61: U$6.4 U$6.6 U$6.8 U$6.10 4,46.67 4,51.12 4,56.03 | 3.49,35.88 2.22,34.61 2.22,31.43 3.81,29.84 v3.81,13.65 15.85,1.62 UP.2 OK.2 | C2.A 83.76,23.81 83.76,20.89 83.5,20.64 83.5,19.37 81.6,17.46 | 84.14,36.89 82.81,36.89 | 82.55,37.15 82.55,39.05 81.92,39.69 81.92,46.68 X1.5 | 77.15,12.74 C9.2 | 79.06,12.7 79.38,12.38 v79.38,10.48 | 79.06,12.7 77.75,12.7 | 79.06,12.7 79.06,13.65 78.42,14.29 78.42,15.56 80.33,17.46 U1.15 | JP6.6 JP6.5 JP6.4 JP6.3 JP6.2 JP6.1 38.42,9.21 36.83,10.79 36.83,12.06 v36.2,12.38
  Bottom 0.813: JP2.8 46.1,69.34 JP2.7 43.56,69.09 JP2.6 41.02,69.34 JP2.5 38.48,69.09 JP2.4 35.94,69.34 JP2.3 33.4,69.09 JP2.2 30.86,69.34 JP2.1 28.57,69.22 25.08,69.22 24.13,68.26 24.13,63.82 22.54,62.23 v22.54,60.64 | IC3.4 45.72,58.74 C4.2
  Bottom 1.016: IC2.3 4.8,64.62 J1.GND 7.94,67.63 13.02,72.71 18.1,72.71 | 18.73,68.9 18.1,69.53 18.1,72.71 | 18.1,72.71 18.1,74.61 | POT1-3362.E 18.41,78.11 19.68,79.69 31.43,79.69 34.29,76.83 35.57,76.83 | U$1.1 35.24,77.16 | IC3.4 40.96,58.74 v39.69,60.01
  Bottom 1.27: 18.73,68.9 v18.73,66.04
  pour Bottom (isolate 1.016, hatched): -27.62,106.68 135.25,105.09 139.06,-17.78 -22.86,-17.14
  pour Top (isolate 2.54, hatched): -8.26,87.31 124.46,85.09 121.28,-30.16 -12.7,-33.97
KD
  Bottom 0.406: IC1.1 13.65,22.54 9.53,18.41 9.53,9.84 16.19,3.17 79.06,3.17 79.38,3.49 R18.2 80.7,4.82 81.28,5.4 81.28,6.32 OK.3
KO
  Bottom 0.406: IC1.3 28.26,21.27 26.35,19.37 13.65,19.37 11.43,17.14 11.43,11.11 17.41,5.13 R22.2 62.6,5.13 63.18,5.71 DOWN.3
KU
  Bottom 0.406: IC1.2 25.72,21.27 24.77,20.32 13.34,20.32 10.48,17.46 10.48,10.48 16.83,4.13 69.22,4.13 69.85,4.76 R23.2 71.49,5.13 71.75,5.4 71.75,6.32 UP.3
MISO
  Bottom 0.254: 9.53,40.32 8.57,41.27 | 11.11,30.48 11.11,32.7
  Bottom 0.305: U$6.9 7.94,43.5 8.57,42.86 8.57,41.27 | 9.53,40.32 9.53,34.29 11.11,32.7 | 11.11,30.48 12.7,28.89 34.92,28.89 38.42,25.4 IC1.7
MOSI
  Bottom 0.305: U$6.1 8.26,33.34 9.84,31.75 9.84,29.53 11.75,27.62 34.29,27.62 35.56,26.35 35.56,22.86 IC1.6
N$1
  Bottom 0.254: IC1.27 56.2,42.55 56.83,43.18 57.47,43.18 58.74,44.45 60.33,44.45 62.23,46.35 67.63,46.35 71.44,50.16 71.44,63.82 67.31,67.94 67.31,68.26 64.45,71.12 61.59,71.12 59.37,73.34 47.62,73.34 46.99,73.98 45.4,73.98 44.45,74.93 43.5,74.93 42.86,75.56 42.86,76.39 U$1.4
N$2
  Bottom 0.254: U$1.5 45.79,75.18 46.35,74.61 47.62,74.61 48.26,73.98 60.01,73.98 61.91,72.07 64.45,72.07 64.77,71.75 65.09,71.75 67.63,69.22 67.63,68.9 68.26,68.26 68.26,67.94 72.07,64.14 72.07,49.85 67.63,45.4 62.23,45.4 60.64,43.81 59.37,43.81 58.74,43.18 IC1.26
N$3
  Bottom 0.254: IC1.25 61.28,43.18 62.55,44.45 67.94,44.45 70.48,46.99 70.48,47.31 73.03,49.85 73.03,64.45 68.26,69.22 68.26,69.53 66.67,71.12 66.67,72.07 65.72,72.07 64.77,73.03 62.23,73.03 60.64,74.61 49.21,74.61 48.9,74.93 48.9,76.21 U$1.6
N$4
  Bottom 0.254: U$1.11 61.03,75.5 61.59,74.93 62.55,74.93 63.5,73.98 64.77,73.98 65.72,73.03 66.99,73.03 67.31,72.71 67.31,71.75 69.53,69.53 69.53,68.9 73.66,64.77 73.66,49.53 71.44,47.31 71.44,46.99 68.26,43.81 64.45,43.81 63.82,43.18 IC1.24
N$5
  Bottom 0.254: IC1.23 66.36,42.86 66.67,43.18 68.58,43.18 72.07,46.67 72.07,46.99 74.3,49.21 74.3,65.09 70.17,69.22 70.17,69.85 67.94,72.07 67.94,73.03 67.31,73.66 66.04,73.66 65.09,74.61 64.14,74.61 63.5,75.25 63.5,76.71 U$1.12
N$6
  Bottom 0.305: C2.C 87.06,34.99 86.04,33.97 86.04,28.26 87.95,28.26 U1.6
N$7
  Bottom 0.254: IC1.21 71.44,43.5 73.66,45.72 73.66,46.04 75.88,48.26 75.88,66.04 71.44,70.48 71.44,71.44 69.53,73.34 69.53,73.66 68.58,74.61 68.58,76.71 U$1.14
N$8
  Bottom 0.305: U1.5 91.38,25.08 C10.C
N$9
  Bottom 0.305: U1.4 92.14,22.54 C10.A
N$10
  Bottom 0.305: U1.1 91.5,14.92 C11.A
N$11
  Bottom 0.813: C3.A 88.33,17.21 U1.2
N$12
  Bottom 0.305: U1.3 91.5,20 C11.C
N$13
  Bottom 0.305: U1.7 89.85,30.16 91.12,31.43 91.12,55.56 89.62,57.06 X1.2
N$14
  Bottom 0.406: 66.36,17.59 66.36,17.78 66.32,17.74
  Bottom 0.61: 66.36,17.78 IC1.18 | 66.36,17.59 Q2.1 | C9.1 66.32,17.74
N$15
  Bottom 0.305: 35.88,73.98 36.83,75.25 36.83,78.11 37.47,79.06 40.64,79.06 40.64,78.42 40.96,78.11 40.96,76.52 40.64,76.2 40.64,76.71 U$1.3
  Bottom 0.406: 25.72,78.11 26.04,77.79
  Bottom 1.016: 26.04,77.79 28.57,73.98 35.88,73.98 | POT1-3362.S 20.95,76.52 22.54,78.11 25.72,78.11
N$16
  Bottom 0.305: U$1.15 71.19,73.96 R1.2
N$17
  Bottom 0.254: R14.2 LED1.K
N$18
  Bottom 0.305: IC1.28 53.66,36.2 54.93,34.92 71.75,34.92 73.66,36.83 73.66,43.18 73.34,43.5 73.34,43.81 76.83,47.31 76.83,67.05 R26.2
N$19
  Bottom 0.305: R1.1 75.39,73.34 T2.C
N$20
  Bottom 0.305: IC1.38 28.26,39.37 27.94,39.69 26.67,39.69 25.72,40.64 25.72,41.27 23.18,43.81 23.18,58.1 24.45,59.37 24.45,60.64 26.04,62.23 29.53,62.23 30.8,63.5 30.8,63.82 U$2.3
  Bottom 0.406: R3.2 IC1.38
N$21
  Bottom 0.305: IC1.37 30.8,39.05 29.53,40.32 27.62,40.32 26.67,41.27 26.67,41.59 24.13,44.13 24.13,57.78 25.08,58.74 25.08,60.01 26.35,61.28 29.84,61.28 30.8,62.23 32.7,62.23 33.34,62.87 33.34,63.82 U$2.5
  Bottom 0.406: R4.2 IC1.37
N$23
  Bottom 0.254: IC1.22 68.9,42.23 72.71,46.04 72.71,46.35 74.93,48.58 74.93,65.72 70.8,69.85 70.8,70.48 68.58,72.71 68.58,73.34 67.31,74.61 66.67,74.61 66.04,75.25 66.04,76.71 U$1.13
N$24
  Bottom 0.305: X1.3 88.27,54.29 90.17,53.02 90.17,34.29 U1.8
N$27
  Bottom 0.305: R8.2 IC1.33 40.96,39.05 43.5,41.59 45.72,41.59 48.26,44.13 52.7,44.13 54.61,46.04 54.61,58.42 51.12,61.91 44.45,61.91 43.81,62.55 U$2.13
N$28
  Bottom 0.305: R10.2 IC1.32 43.5,39.37 44.77,40.64 46.04,40.64 48.58,43.18 53.34,43.18 55.56,45.4 55.56,59.05 50.48,64.14 U$2.15
N$29
  Bottom 0.406: IC1.5 33.34,21.59 31.43,19.68 30.16,19.68 27.3,16.83 JP4.3
N$30
  Bottom 0.305: JP5.1 39.37,15.56 40.32,16.51 42.86,16.51 43.81,17.46 46.99,17.46 49.85,20.32 50.48,20.32 51.12,20.95 IC1.12
N$31
  Bottom 0.305: JP5.2 41.91,15.24 42.55,15.88 43.18,15.88 44.13,16.83 47.62,16.83 50.16,19.37 52.07,19.37 53.66,20.95 IC1.13
N$32
  Bottom 0.305: JP5.3 44.45,15.24 45.09,15.88 47.94,15.88 50.48,18.41 52.39,18.41 54.29,20.32 55.56,20.32 56.2,20.95 IC1.14
N$33
  Bottom 0.305: JP5.4 48.9,15.88 49.21,15.88 50.8,17.46 52.7,17.46 54.61,19.37 56.2,19.37 57.47,20.64 58.1,20.64 58.74,21.27 IC1.15
N$34
  Bottom 0.406: 73.66,15.37 73.66,16.19
  Bottom 0.61: IC1.19 68.9,18.73 69.53,18.1 71.75,18.1 72.43,17.42 | 73.66,16.19 72.43,17.42 | Q2.2 73.66,15.37 | 72.43,17.42 C8.1
N$35
  Bottom 0.305: JP5.5 49.53,14.61 51.44,16.51 52.7,16.51 54.93,18.73 56.83,18.73 58.1,20 59.37,20 60.01,20.64 60.96,20.64 61.59,21.27 61.59,22.23 IC1.16
N$36
  Bottom 0.305: JP5.6 55.56,17.78 57.15,17.78 58.74,19.37 60.96,19.37 62.23,20.64 63.5,20.64 64.14,21.27 64.14,22.23 IC1.17
N$37
  Bottom 0.305: Q1.2 39.05,46.35 39.69,46.99 39.69,52.39 40.96,53.66 IC3.2
N$38
  Bottom 0.305: Q1.1 38.42,52.7 41.91,56.2 IC3.3
N$39
  Bottom 0.254: 41.27,57.47 44.13,57.47 44.77,56.83 BAT1.1
  Bottom 0.305: IC3.8 36.83,51.12 37.47,51.44 37.47,53.66 41.27,57.47
N$40
  Bottom 0.305: JP8.1 IC3.7
N$41
  Bottom 0.305: JP9.1 IC3.6
N$42
  Bottom 0.305: JP10.1 IC3.5
N$55
  Bottom 0.305: T2.B 76.52,72.34 R26.1
P0.0
  Bottom 0.305: IC1.39 25.72,39.37 24.77,40.32 24.77,41.27 22.54,43.5 22.54,58.42 23.81,59.69 23.81,61.28 26.35,63.82 28.26,63.82 U$2.1
  Bottom 0.406: R2.2 IC1.39
RST
  Bottom 0.254: R9.1 13.02,46.67 16.19,49.85 17.78,49.85 | 17.75,47.97 U$8.2
  Bottom 0.305: U$6.5 5.71,38.42 5.4,38.73 5.4,44.45 6.03,45.09 | 9.21,43.18 8.89,43.5 | 10.16,40.64 10.16,34.61 11.75,33.02 11.75,31.11 13.34,29.53 35.56,29.53 39.37,25.72 42.86,25.72 43.5,25.08 IC1.9
  Bottom 0.406: 7.62,45.09 8.26,45.09 8.89,44.45 8.89,43.5 | 7.62,45.09 6.03,45.09 | 9.21,43.18 9.21,41.59 10.16,40.64 | R9.1 7.88,45.35 7.62,45.09
  Bottom 0.813: C14.C 17.78,49.85 17.78,48.58 17.75,47.97
RXD2
  Bottom 0.305: U1.9 78.42,32.7 75.88,30.16 51.12,30.16 46.04,25.08 IC1.10
  Bottom 0.406: IC1.10 46.04,20.32 45.09,19.37 42.23,19.37 41.27,18.41 32.38,18.41 31.11,17.14 31.11,8.26 30.48,7.62 27.94,7.62 27.3,8.26 JP3.3
SCK
  Bottom 0.254: 37.15,20.64 37.47,20.32 40.64,20.32 40.96,20.64 IC1.8
  Bottom 0.305: U$6.7 7.94,40.96 8.89,40.01 8.89,33.97 10.48,32.38 10.48,29.84 12.06,28.26 34.61,28.26 37.15,25.72 37.15,20.64
TXD2
  Bottom 0.305: IC1.11 48.58,26.67 51.44,29.53 80.33,29.53 U1.10
  Bottom 0.406: JP3.4 24.77,7.62 25.4,6.99 33.02,6.99 34.29,8.26 34.29,16.19 35.88,17.46 42.55,17.46 43.5,18.41 46.35,18.41 48.58,20.95 IC1.11
VCC  (via drill 0.74 pad 1.5, 0.74 pad 1.68)
  Top 0.254: 10.16,47.62 9.84,47.62
  Top 1.016: 10.16,41.91 10.79,41.27 | 9.53,44.77 9.53,43.81 | 10.48,47.94 10.16,47.62
  Top 1.676: v7.94,31.11 11.75,31.11 12.38,32.07 12.38,33.34 10.79,34.92 10.79,41.27 | 10.16,41.91 10.16,43.18 9.53,43.81 | 9.53,44.77 8.89,45.4 8.89,46.67 9.84,47.62 | v12.38,47.94 10.48,47.94 | v68.9,63.5 v79.38,63.5 | v46.35,51.12 52.7,57.47 v52.7,66.99 v52.7,72.07
  Bottom 0.254: 18.1,57.47 C14.A | 80.33,71.44
  Bottom 0.305: T2.E 78.74,71.44 79.06,71.75 | 17.46,57.49 17.78,57.78 | JP7.4 JP7.3 | JP7.5 50.16,11.75 | 53.34,11.43 JP7.6 | 46.67,66.99 U$2.16 | 35.88,33.34 R6.1 | 38.42,33.34 R7.1 | 40.96,33.34 R8.1 | 43.5,33.34 R10.1
  Bottom 0.406: U$6.2 4,31.56 4.45,31.11 v7.94,31.11 | U1.16 80.96,9.84 79.69,8.57 | U$8.3 17.81,42.86 | 13.97,53.98 14.29,53.66 | 12.16,53.98 IC2.2 | 18.66,57.47 18.34,57.78 | 21.24,42.89 21.27,42.92 | C14.A 17.46,57.81 | C1.A 45.91,30.98 45.56,30.64 | 45.56,30.64 44.77,29.84 44.77,20.64 44.13,20 41.59,20 40.96,19.37 32.38,19.37 31.43,18.41 30.48,18.41 29.84,17.78 JP4.2 29.84,12.7 | 69.85,8.57 61.59,8.57 61.28,8.26 R22.1 61.23,6.99 58.74,6.99 57.78,6.03 54.61,6.03 | 69.85,8.57 79.69,8.57 | R18.1 79.38,8.26 79.69,8.57 | 69.85,8.57 R23.1 | 25.72,33.34 R2.1 | R3.1 28.26,33.39 27.94,33.34 | 30.8,33.34 R4.1 | 33.34,33.34 R5.1 | 29.84,12.7 JP3.2 | 19.37,12.7 IC5.3 19.37,7.3 20.64,6.03 54.61,6.03 | 19.37,12.7 R27.1 | 19.37,12.7 29.84,12.7 | 53.34,11.43 54.61,10.16 54.61,6.03 | C12.1 45.56,30.48 45.56,30.64
  Bottom 0.61: 18.34,57.78 18.1,57.47 | C1.A 46.04,33.47 | JP7.1 JP7.2 JP7.3 | JP7.4 JP7.5 JP7.6
  Bottom 0.813: 46.04,33.47 IC1.31 | C1.A 43.5,33.34 40.96,33.34 38.42,33.34 35.88,33.34 33.34,33.34 30.8,33.34 27.94,33.34 25.72,33.34 25.08,33.34 23.18,35.24 IC1.40 23.18,40.96 21.24,42.89 U$8.3 | 81.98,13.91 C3.C | 18.66,57.47 19.37,57.47 21.27,55.56 21.27,42.92 | 80.33,71.44 T2.E | 80.33,71.44 80.33,65.09 v79.38,63.5 | v68.9,63.5 62.87,69.85 60.9,69.85 58.74,72.07 v52.7,72.07 39.05,72.07 38.42,72.71 | 13.97,53.98 12.16,53.98 | U$1.2 38.17,72.96 38.42,72.71 | 38.42,72.71 38.1,72.39 23.5,72.39 POT1-3362.A | U$2.2 U$2.4 U$2.6 U$2.8 U$2.10 U$2.12 U$2.14 U$2.16 | C13.A 22.36,71.44 23.31,72.39 | v52.7,66.99 46.67,66.99 | IC3.1 v46.35,51.12 C4.1
  Bottom 1.016: v12.38,47.94 12.38,48.9 LED1.A 14.29,53.66 | U1.16 81.98,13.91 | C14.A 17.46,57.49 14.63,57.49 13.97,56.83 13.97,53.98 | 23.31,72.39 23.5,72.39
  Bottom 1.27: C13.A 22.36,64.58 21.59,63.82 18.1,63.82 17.46,63.18 17.46,57.49

### Text on the board
Top: Digital | - | + | S | I | S | + | R | - | Digital | I2C-> | D.SC+.- | 51-Zduino V1 | R232-> | TXRX+- | 2011.2.2